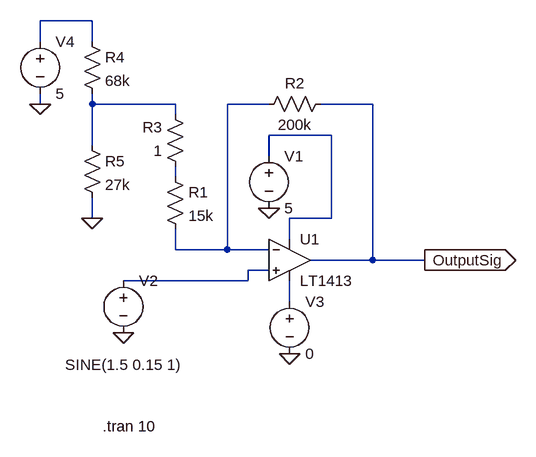
[diagram p0: schematic AmplifierModel.asc]
AmplifierModel.asc, the LTspice schematic file:
Version 4
SHEET 1 880 680
WIRE -112 -224 -192 -224
WIRE -192 -192 -192 -224
WIRE -112 -192 -112 -224
WIRE -192 -96 -192 -112
WIRE -112 -96 -112 -112
WIRE 16 -96 -112 -96
WIRE 160 -96 96 -96
WIRE 320 -96 240 -96
WIRE 16 -80 16 -96
WIRE 256 -48 160 -48
WIRE -112 -32 -112 -96
WIRE 160 -16 160 -48
WIRE 16 16 16 0
WIRE -112 80 -112 48
WIRE 256 80 256 -48
WIRE 256 80 192 80
WIRE 192 112 192 80
WIRE 16 128 16 96
WIRE 96 128 96 -96
WIRE 96 128 16 128
WIRE 160 128 96 128
WIRE 320 144 320 -96
WIRE 320 144 224 144
WIRE 400 144 320 144
WIRE 160 160 128 160
WIRE 128 176 128 160
WIRE 128 176 -64 176
WIRE 192 208 192 176
FLAG 160 64 0
FLAG 400 144 OutputSig
IOPIN 400 144 Out
FLAG -64 256 0
FLAG 192 288 0
FLAG -192 -96 0
FLAG -112 80 0
SYMBOL OpAmps\\LT1413 192 80 R0
SYMATTR InstName U1
SYMBOL res 0 0 R0
SYMATTR InstName R1
SYMATTR Value 15k
SYMBOL res 256 -112 R90
WINDOW 0 0 56 VBottom 2
WINDOW 3 32 56 VTop 2
SYMATTR InstName R2
SYMATTR Value 200k
SYMBOL voltage 160 -32 R0
WINDOW 123 0 0 Left 0
WINDOW 39 0 0 Left 0
SYMATTR InstName V1
SYMATTR Value 5
SYMBOL voltage -64 160 R0
WINDOW 3 -90 145 Left 2
WINDOW 123 0 0 Left 0
WINDOW 39 0 0 Left 0
SYMATTR Value SINE(1.5 0.15 1)
SYMATTR InstName V2
SYMBOL voltage 192 192 R0
WINDOW 123 0 0 Left 0
WINDOW 39 0 0 Left 0
SYMATTR InstName V3
SYMATTR Value 0
SYMBOL res 32 16 R180
WINDOW 0 36 76 Left 2
WINDOW 3 36 40 Left 2
SYMATTR InstName R3
SYMATTR Value 1
SYMBOL res -128 -208 R0
SYMATTR InstName R4
SYMATTR Value 68k
SYMBOL res -128 -48 R0
SYMATTR InstName R5
SYMATTR Value 27k
SYMBOL voltage -192 -208 R0
WINDOW 123 0 0 Left 0
WINDOW 39 0 0 Left 0
SYMATTR InstName V4
SYMATTR Value 5
TEXT -96 400 Left 2 !.tran 10

The netlist it stands for:
* AmplifierModel.asc
XU1 N006 N003 N004 N007 OutputSig LT1413  ; pins In+ In- V+ V- OUT
R1 N005 N003 15k
R2 OutputSig N003 200k
V1 N004 0 5
V2 N006 0 SINE(1.5 0.15 1)
V3 N007 0 0
R3 N005 N002 1
R4 N001 N002 68k
R5 N002 0 27k
V4 N001 0 5
.tran 10
.lib LTC.lib
.backanno
.end